# EAGLE schematic RouterR1 (EAGLE 6.3)
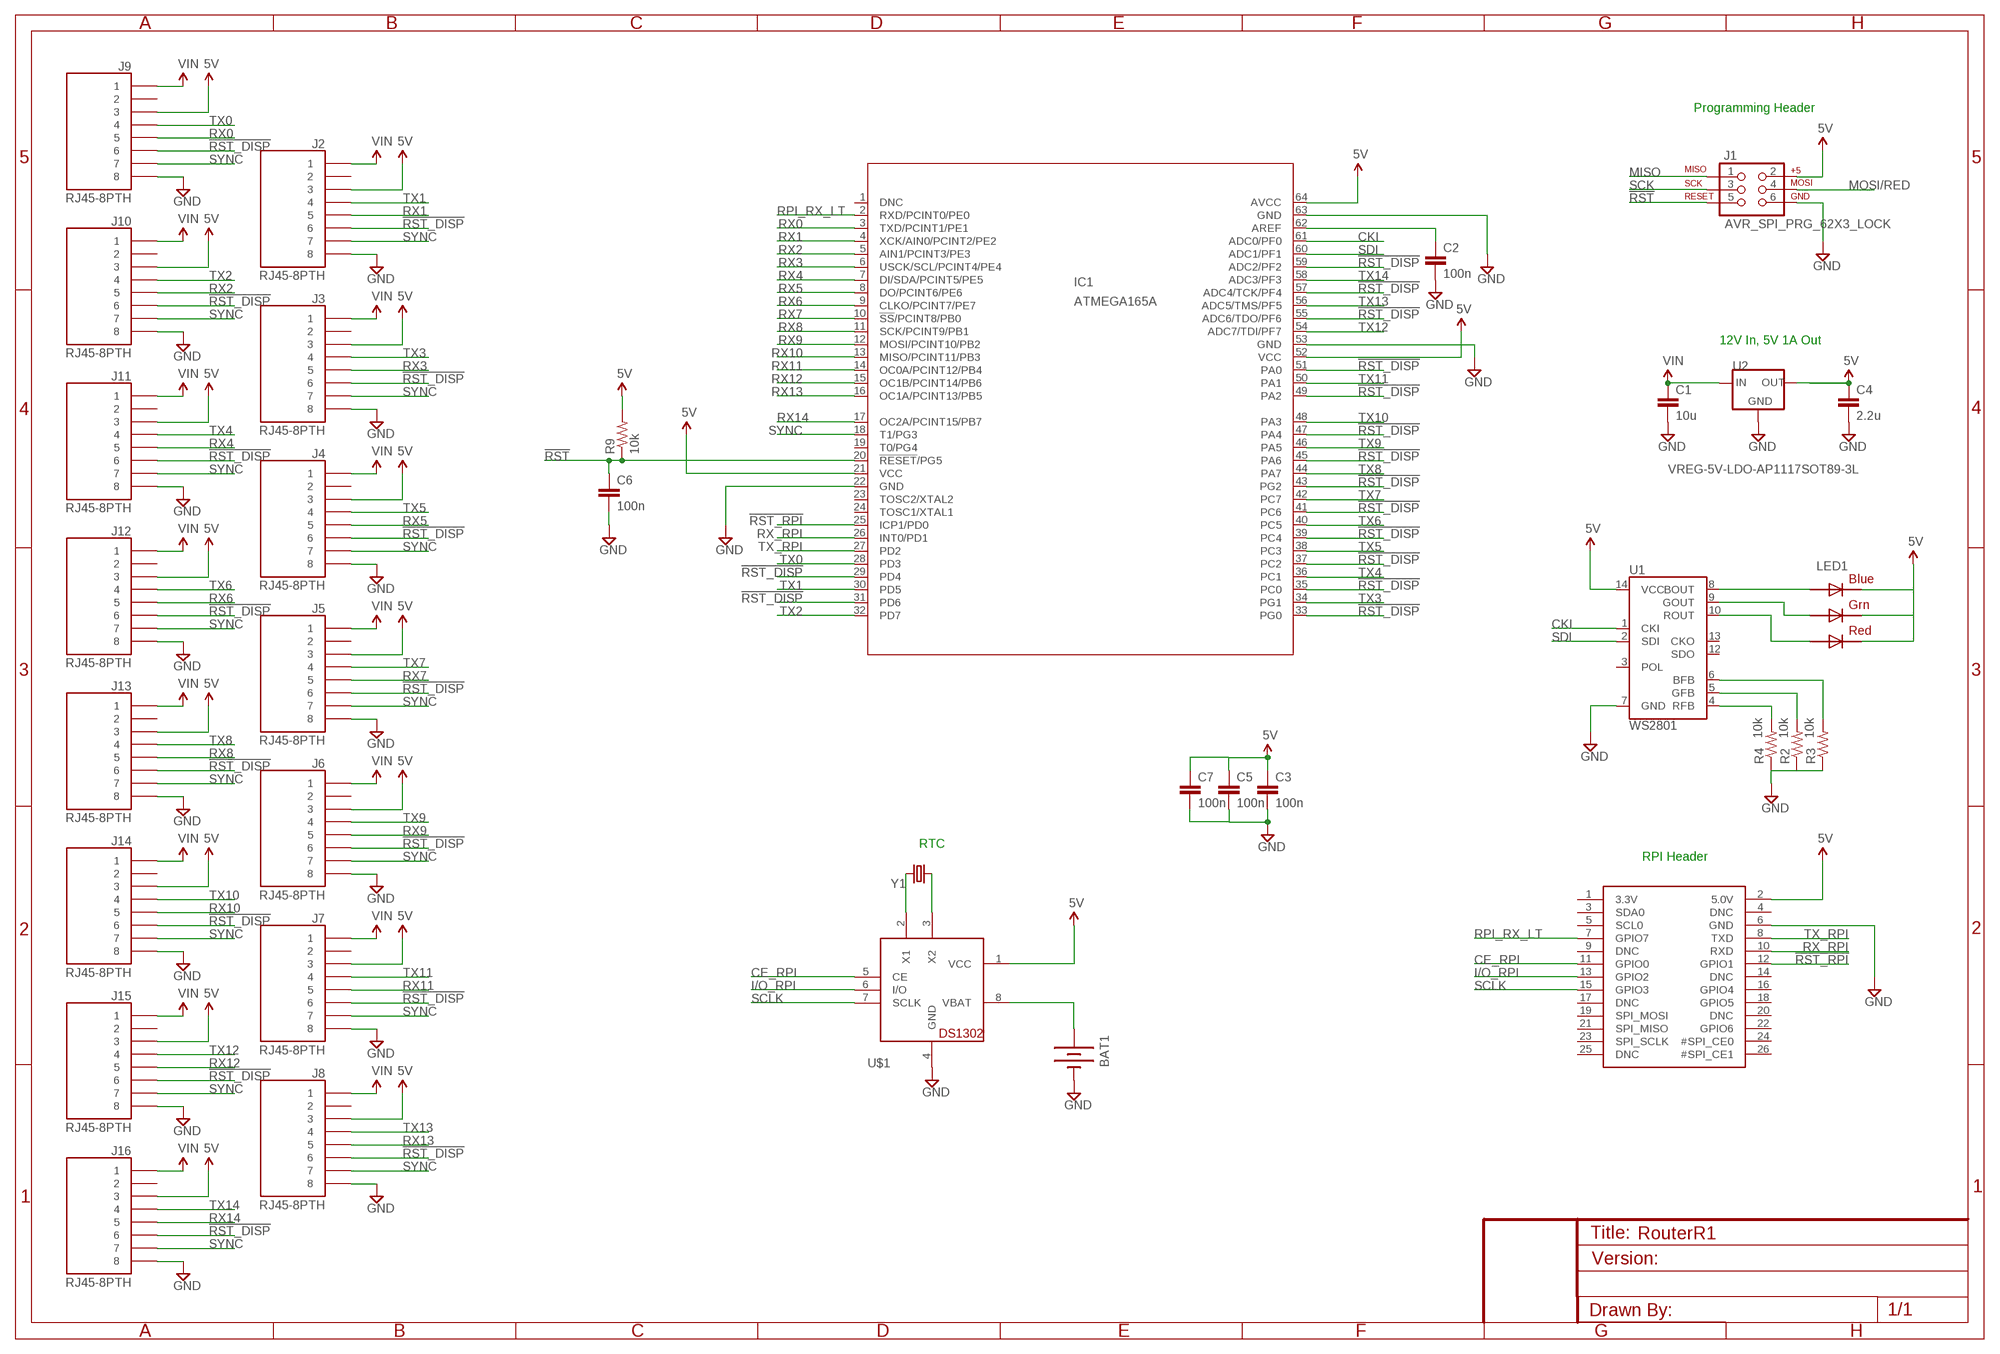
[diagram p0: schematic, sheet 1]

## Parts
BAT1  BATTERY20SMD  [BATTCON_20MM]
C1  10u  CAP0603-CAP  [0603-CAP]
C2  100n  CAP0603-CAP  [0603-CAP]
C3  100n  CAP0603-CAP  [0603-CAP]
C4  2.2u  CAP0603-CAP  [0603-CAP]
C5  100n  CAP0603-CAP  [0603-CAP]
C6  100n  CAP0603-CAP  [0603-CAP]
C7  100n  CAP0603-CAP  [0603-CAP]
IC1  ATMEGA165A  [64M1]
J1  AVR_SPI_PRG_62X3_LOCK  [2X3_LOCK]
J2  RJ45-8PTH  [RJ45-8]
J3  RJ45-8PTH  [RJ45-8]
J4  RJ45-8PTH  [RJ45-8]
J5  RJ45-8PTH  [RJ45-8]
J6  RJ45-8PTH  [RJ45-8]
J7  RJ45-8PTH  [RJ45-8]
J8  RJ45-8PTH  [RJ45-8]
J9  RJ45-8PTH  [RJ45-8]
J10  RJ45-8PTH  [RJ45-8]
J11  RJ45-8PTH  [RJ45-8]
J12  RJ45-8PTH  [RJ45-8]
J13  RJ45-8PTH  [RJ45-8]
J14  RJ45-8PTH  [RJ45-8]
J15  RJ45-8PTH  [RJ45-8]
J16  RJ45-8PTH  [RJ45-8]
LED1  RGBLED5050  [RGBLED5050]
R2  10k  RESISTOR0603-RES  [0603-RES]
R3  10k  RESISTOR0603-RES  [0603-RES]
R4  10k  RESISTOR0603-RES  [0603-RES]
R9  10k  RESISTOR0603-RES  [0603-RES]
U1  WS2801  [SOP-14]
U2  VREG-5V-LDO-AP1117SOT89-3L  [SOT89-3L]
U$1  DS1302_SMT  [SO08]
U$38  RASPBERRYPI_BB  [RASBERRYPI_SHIELD]
Y1  CRYSTALTC26H_EZ  [TC26HEZ]

## Nets
5V: C3.1 C4.1 C5.1 C7.1 IC1.21(VCC) IC1.52(VCC) J1.2 J2.3 J3.3 J4.3 J5.3 J6.3 J7.3 J8.3 J9.3 J10.3 J11.3 J12.3 J13.3 J14.3 J15.3 J16.3 LED1.4(BLUE_C) LED1.5(RED_C) LED1.6(GREEN_C) R9.2 U1.14(VCC) U2.2(OUT) U2.2.1(OUT) U$1.1(VCC) U$38.2(5.0V)
!RST: C6.1 J1.5 R9.1
!RST_DISP: J2.6 J3.6 J4.6 J5.6 J6.6 J7.6 J8.6 J9.6 J10.6 J11.6 J12.6 J13.6 J14.6 J15.6 J16.6
CE_RPI: U$1.5(CE) U$38.11(GPIO0)
CKI: IC1.61(ADC0/PF0) U1.1(CKI)
GND: BAT1.2(-) C1.2 C2.2 C3.2 C4.2 C5.2 C6.2 C7.2 IC1.22(GND) IC1.63(GND) J1.6 J2.8 J3.8 J4.8 J5.8 J6.8 J7.8 J8.8 J9.8 J10.8 J11.8 J12.8 J13.8 J14.8 J15.8 J16.8 R2.1 R3.1 R4.1 U1.7(GND) U2.1(GND) U$1.4(GND) U$38.6(GND)
I/O_RPI: U$1.6(I/O) U$38.13(GPIO2)
MISO: J1.1
MOSI/RED: J1.4
MOT_A: C1.1 J2.1 J3.1 J4.1 J5.1 J6.1 J7.1 J8.1 J9.1 J10.1 J11.1 J12.1 J13.1 J14.1 J15.1 J16.1 U2.3(IN) ; supply symbol labelled VIN
N$1: BAT1.1(+) U$1.8(VBAT)
N$2: U$38.8(TXD)
N$3: U$38.10(RXD)
N$4: C2.1 IC1.62(AREF)
N$5: U$38.12(GPIO1)
N$6: U$1.3(X2) Y1.1
N$7: U$1.2(X1) Y1.2
N$9: LED1.3(BLUE_A) U1.8(BOUT)
N$10: LED1.1(GREEN_A) U1.9(GOUT)
N$11: LED1.2(RED_A) U1.10(ROUT)
N$12: R4.2 U1.4(RFB)
N$13: R2.2 U1.5(GFB)
N$14: R3.2 U1.6(BFB)
RPI_RX_LT: IC1.2(RXD/PCINT0/PE0) U$38.7(GPIO7)
RX0: J9.5
RX1: J2.5
RX2: J10.5
RX3: J3.5
RX4: J11.5
RX5: J4.5
RX6: J12.5
RX7: J5.5
RX8: J13.5
RX9: J6.5
RX10: J14.5
RX11: J7.5
RX12: J15.5
RX13: J8.5
RX14: IC1.17(OC2A/PCINT15/PB7) J16.5
SCK: J1.3
SCLK: U$1.7(SCLK) U$38.15(GPIO3)
SDI: IC1.60(ADC1/PF1) U1.2(SDI)
SYNC: J9.7
TX0: J9.4
TX1: J2.4
TX2: J10.4
TX3: J3.4
TX4: J11.4
TX5: J4.4
TX6: J12.4
TX7: J5.4
TX8: J13.4
TX9: J6.4
TX10: J14.4
TX11: J7.4
TX12: J15.4
TX13: J8.4
TX14: J16.4
Unconnected: IC1.1(DNC) IC1.3(TXD/PCINT1/PE1) IC1.4(XCK/AIN0/PCINT2/PE2) IC1.5(AIN1/PCINT3/PE3) IC1.6(USCK/SCL/PCINT4/PE4) IC1.7(DI/SDA/PCINT5/PE5) IC1.8(DO/PCINT6/PE6) IC1.9(CLKO/PCINT7/PE7) IC1.10(!SS!/PCINT8/PB0) IC1.11(SCK/PCINT9/PB1) IC1.12(MOSI/PCINT10/PB2) IC1.13(MISO/PCINT11/PB3) IC1.14(OC0A/PCINT12/PB4) IC1.15(OC1B/PCINT14/PB6) IC1.16(OC1A/PCINT13/PB5) IC1.18(T1/PG3) IC1.19(T0/PG4) IC1.20(!RESET!/PG5) IC1.23(TOSC2/XTAL2) IC1.24(TOSC1/XTAL1) IC1.25(ICP1/PD0) IC1.26(INT0/PD1) IC1.27(PD2) IC1.28(PD3) IC1.29(PD4) IC1.30(PD5) IC1.31(PD6) IC1.32(PD7) IC1.33(PG0) IC1.34(PG1) IC1.35(PC0) IC1.36(PC1) IC1.37(PC2) IC1.38(PC3) IC1.39(PC4) IC1.40(PC5) IC1.41(PC6) IC1.42(PC7) IC1.43(PG2) IC1.44(PA7) IC1.45(PA6) IC1.46(PA5) IC1.47(PA4) IC1.48(PA3) IC1.49(PA2) IC1.50(PA1) IC1.51(PA0) IC1.54(ADC7/TDI/PF7) IC1.55(ADC6/TDO/PF6) IC1.56(ADC5/TMS/PF5) IC1.57(ADC4/TCK/PF4) IC1.58(ADC3/PF3) IC1.59(ADC2/PF2) J2.2 J2.7 J3.2 J3.7 J4.2 J4.7 J5.2 J5.7 J6.2 J6.7 J7.2 J7.7 J8.2 J8.7 J9.2 J10.2 J10.7 J11.2 J11.7 J12.2 J12.7 J13.2 J13.7 J14.2 J14.7 J15.2 J15.7 J16.2 J16.7 U1.3(POL) U1.12(SDO) U1.13(CKO) U$38.1(3.3V) U$38.3(SDA0) U$38.4(DNC) U$38.5(SCL0) U$38.9(DNC) U$38.14(DNC) U$38.16(GPIO4) U$38.17(DNC) U$38.18(GPIO5) U$38.19(SPI_MOSI) U$38.20(DNC) U$38.21(SPI_MISO) U$38.22(GPIO6) U$38.23(SPI_SCLK) U$38.24(#SPI_CE0) U$38.25(DNC) U$38.26(#SPI_CE1)

## Notes on the sheet
- Programming Header
- 12V In, 5V 1A Out
- RTC
- RPI Header

## Power pins joined to a net without a drawn wire
AVCC: IC1.64(AVCC)
GND: IC1.53(GND)

## Library data of the parts
BAT1 = SparkFun-Electromechanical:BATTERY: Battery Holders Various common sizes : AA, AAA, 20mm coin cell and 12mm coin cell.
C1 C4 = SparkFun-Passives:CAP: Capacitor Standard 0603 ceramic capacitor, and 0.1" leaded capacitor.
C2 C3 C5-C7 = SparkFun:CAP: Capacitor Standard 0603 ceramic capacitor, and 0.1" leaded capacitor.
IC1 = pierre:ATMEGA165A: 8-bit Microcontroller with 32K Bytes In-System Programmable Flash Source: http://www.atmel.com .. doc8023.pdf; MPN: ATMEGA165A-AU; OC_FARNELL: 1636939; OC_NEWARK: 03P2025
J1 = SparkFun-Connectors:AVR_SPI_PRG_6: AVR ISP 6 Pin This is the reduced ISP connector for AVR programming. Common on Arduino. This footprint will take up less PCB space and can be used with a 10-pin to 6-pin adapter such as SKU: BOB-08508
J2-J16 = SparkFun:RJ45-8: RJ45 Jack Simple RJ45, 8-pin connection - connector for common Cat5, Cat5e, and Cat6 Ethernet cables. Footprint not yet proven in production. Connector sku is PRT-00643; Breakout PCB sku is BOB-00716.
LED1 = adafruit:RGBLED: For 5050 RGB LEDs, the order of the LEDs may vary from one manufacturer to another!
R2-R4 R9 = SparkFun-Resistors:RESISTOR: Resistor Basic schematic elements and footprints for 0603, 1206, and PTH resistors.
U1 = SparkFun-DigitalIC:WS2801: WS2801 3 Channel Constant Current LED Driver with programmable PWM outputs. Datasheet: http://www.sparkfun.com/datasheets/Components/LED/WS2801.pdf
U2 = pierre:VREG-5V-LDO-AP1117
U$1 = pierre:DS1302_SMT
U$38 = microbuilder:RASPBERRYPI_B
Y1 = pierre:CRYSTAL: Various standard crystals. Proven footprints. Spark Fun Electronics SKU : COM-00534